# Altium project ArduinoShield.PrjPcb
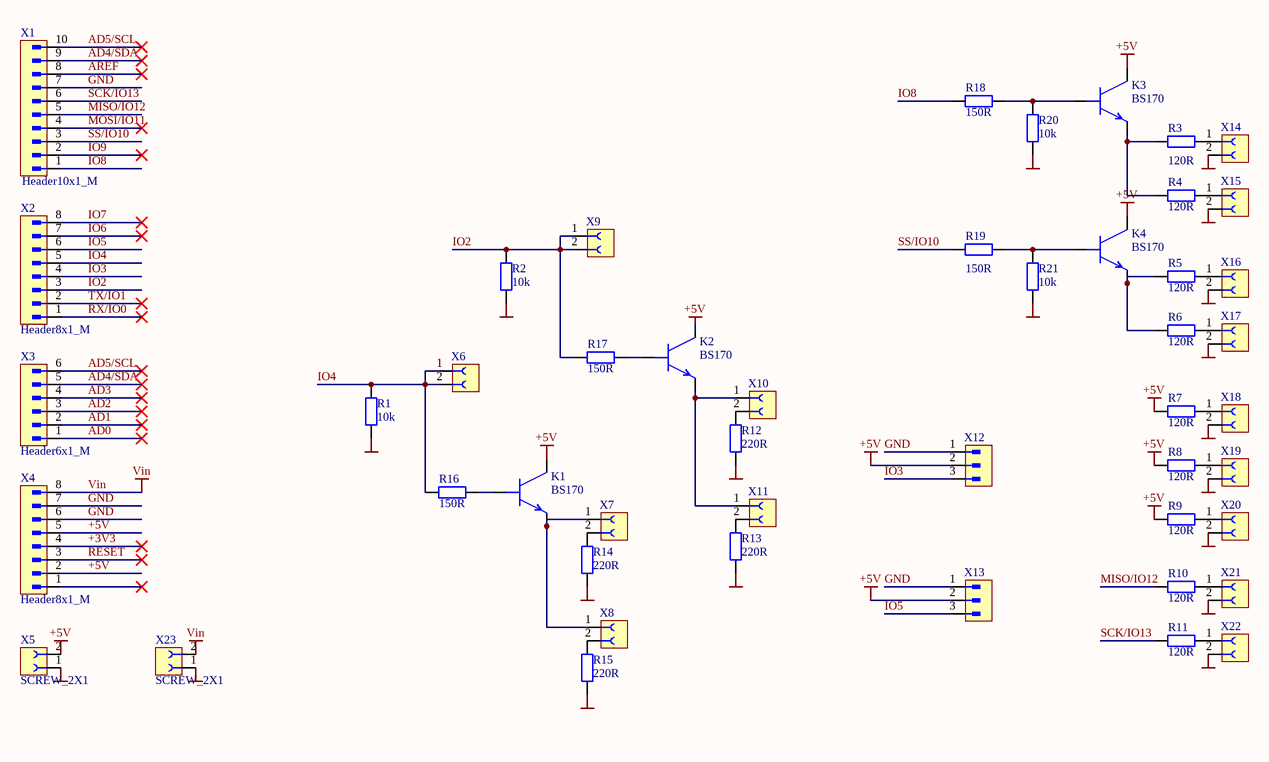
[diagram p0: ArduinoShield.SchDoc]
Author: ACL; ProjectNumber: Shld0.2_Eurobot2022; Revision: 1.1; Title: Shield
1 sheet, 48 parts. Net scope: global (net labels, ports and power ports of the same name join across sheets).
Board file: ArduinoShield.PcbDoc

## Sheet ArduinoShield.SchDoc: Shield
size A3; Organization1: Centre professionnel; Address1: Rue Roger-de-Guimps 41; Address2: CH-1401 Yverdon-les-Bains; Address4: Switzerland; SheetNumber: 1; SheetTotal: 1; Organization2: du Nord vaudois

### Parts
K1  BS170  [TO-92]
K2  BS170  [TO-92]
K3  BS170  [TO-92]
K4  BS170  [TO-92]
R1  10k  [AXIAL-1/2W]
R2  10k  [AXIAL-1/2W]
R3  120R  [AXIAL-1/2W]
R4  120R  [AXIAL-1/2W]
R5  120R  [AXIAL-1/2W]
R6  120R  [AXIAL-1/2W]
R7  120R  [AXIAL-1/2W]
R8  120R  [AXIAL-1/2W]
R9  120R  [AXIAL-1/2W]
R10  120R  [AXIAL-1/2W]
R11  120R  [AXIAL-1/2W]
R12  220R  [AXIAL-1/2W]
R13  220R  [AXIAL-1/2W]
R14  220R  [AXIAL-1/2W]
R15  220R  [AXIAL-1/2W]
R16  150R  [AXIAL-1/2W]
R17  150R  [AXIAL-1/2W]
R18  150R  [AXIAL-1/2W]
R19  150R  [AXIAL-1/2W]
R20  10k  [AXIAL-1/2W]
R21  10k  [AXIAL-1/2W]
X1  Header10x1_M  [HDR10X1_M]
X2  Header8x1_M  [HDR8X1_M]
X3  Header6x1_M  [HDR6X1_M]
X4  Header8x1_M  [HDR8X1_M]
X5  SCREW_2X1  [691210910002]
X6  SCREW_2X1  [691210910002]  (value not drawn)
X7  SCREW_2X1  [691210910002]  (value not drawn)
X8  SCREW_2X1  [691210910002]  (value not drawn)
X9  SCREW_2X1  [691210910002]  (value not drawn)
X10  SCREW_2X1  [691210910002]  (value not drawn)
X11  SCREW_2X1  [691210910002]  (value not drawn)
X12  Header3x1_M  [HDR3X1_M]  (value not drawn)
X13  Header3x1_M  [HDR3X1_M]  (value not drawn)
X14  SCREW_2X1  [691210910002]  (value not drawn)
X15  SCREW_2X1  [691210910002]  (value not drawn)
X16  SCREW_2X1  [691210910002]  (value not drawn)
X17  SCREW_2X1  [691210910002]  (value not drawn)
X18  SCREW_2X1  [691210910002]  (value not drawn)
X19  SCREW_2X1  [691210910002]  (value not drawn)
X20  SCREW_2X1  [691210910002]  (value not drawn)
X21  SCREW_2X1  [691210910002]  (value not drawn)
X22  SCREW_2X1  [691210910002]  (value not drawn)
X23  SCREW_2X1  [691210910002]

### Nets
+5V: K1.1(C) K2.1(C) K3.1(C) K4.1(C) R7.1 R8.1 R9.1 X4.2 X4.5 X5.2 X12.2 X13.2
GND: R1.2 R2.2 R12.2 R13.2 R14.2 R15.2 R20.2 R21.2 X1.7 X4.6 X4.7 X5.1 X12.1 X13.1 X14.2 X15.2 X16.2 X17.2 X18.2 X19.2 X20.2 X21.2 X22.2 X23.1
Vin: X4.8 X23.2
+3V3: X4.4
AD0: X3.1
AD1: X3.2
AD2: X3.3
AD3: X3.4
AD4/SDA: X1.9 X3.5
AD5/SCL: X1.10 X3.6
AREF: X1.8
IO2: R2.1 R17.1 X2.3 X9.1 X9.2
IO3: X2.4 X12.3
IO4: R1.1 R16.1 X2.5 X6.1 X6.2
IO5: X2.6 X13.3
IO6: X2.7
IO7: X2.8
IO8: R18.1 X1.1
IO9: X1.2
MISO/IO12: R10.1 X1.5
MOSI/IO11: X1.4
RESET: X4.3
RX/IO0: X2.1
SCK/IO13: R11.1 X1.6
SS/IO10: R19.1 X1.3
TX/IO1: X2.2
NetK1_2: K1.2(B) R16.2
NetK1_3: K1.3(E) X7.1 X8.1
NetK2_2: K2.2(B) R17.2
NetK2_3: K2.3(E) X10.1 X11.1
NetK3_2: K3.2(B) R18.2 R20.1
NetK3_3: K3.3(E) R3.1 R4.1
NetK4_2: K4.2(B) R19.2 R21.1
NetK4_3: K4.3(E) R5.1 R6.1
NetR3_2: R3.2 X14.1
NetR4_2: R4.2 X15.1
NetR5_2: R5.2 X16.1
NetR6_2: R6.2 X17.1
NetR7_2: R7.2 X18.1
NetR8_2: R8.2 X19.1
NetR9_2: R9.2 X20.1
NetR10_2: R10.2 X21.1
NetR11_2: R11.2 X22.1
NetR12_1: R12.1 X10.2
NetR13_1: R13.1 X11.2
NetR14_1: R14.1 X7.2
NetR15_1: R15.1 X8.2

Not connected (* = marked no-connect by the designer): X4 1*

### Notes on the sheet
- Date:
- Auteur:
- File:
- Format:
- Rev.
- of
- A3

### Library data of the parts
K1-K4 = CMP-013-00045-3: Small Signal Bipolar Transistor, 0.1A I(C), 65V V(BR)CEO, 1-Element, NPN, Silicon, TO-92; hFE: 400; Ic max: 100mA; Vce sat: 600mV; Power: 625mW; Mounting Technology: THT; Pins: 3; Min Operating Temperature: -55°C; Transistor Type: NPN; RoHS Compliant: Yes; Case/Package: TO 92; Max Operating Temperature: 150°C
R1-R21 = RES: Resistor; Supplier 1: CPNV
X1 = CMP-031-000016-3: WURTH ELEKTRONIK - 61301011121 - Pin Header, Board-to-Board, 2.54 mm, 1 Rows, 10 Contacts, Through Hole, WR-PHD Series; Manufacturer: Wurth Electronics; Gender: Male; Connector Type: Male Pin; Voltage Rating: 250V; Insulation Resistance: 1GR; Number of Contacts: 10; Pitch: 2.54mm; Current Rating: 3A; ComponentLink2URL: https://datasheet.ciiva.com/7631/1442175-7631321.pdf?src-supplier=Element14; Pricing 1: 1=0.89000, 10=0.87400, 50=0.73900, 100=0.67200, 1000=0.42700, 10000=0.42700 (USD); ComponentLink1Description: https://datasheet.ciiva.com/738/6130xx11121-738550.pdf?src-supplier=Digi-Key; RoHS Compliant: Yes; Source: MEION_Connectors.SchLib; Pricing 2: 1=0.89000, 10=0.87400, 50=0.80600, 100=0.73900, 200=0.67200 (USD); Contact Gender: Male; Contact Mating Length: 0.236inch; Design Item ID: Header10x1_M; RoHS: Yes; ComponentLink3URL: https://datasheet.ciiva.com/48700/001088187-da-01-en-wr-phd-tht-stiftleiste-61301011121-48700876.pdf?src-supplier=Conrad; Category: Headers and Wire Housings; Contact Type: Male Pin; Contact Plating: Gold; Stock 1: 1900; Mount: Through Hole; ComponentLink1URL: https://datasheet.ciiva.com/738/6130xx11121-738550.pdf?src-supplier=Digi-Key; Package Quantity: 1000; Manufacturer Part Number: 61301011121; Max Operating Temperature: 125°C; Number of Rows: 1; Flammability Rating: UL94 V-0; ComponentLink3Description: https://datasheet.ciiva.com/48700/001088187-da-01-en-wr-phd-tht-stiftleiste-61301011121-48700876.pdf?src-supplier=Conrad; Min Operating Temperature: -40°C; Stock 2: 4313; Termination: Solder; Packaging: Bulk; Length: 2.54mm; ComponentLink2Description: https://datasheet.ciiva.com/7631/1442175-7631321.pdf?src-supplier=Element14; Number of Positions: 10; REACH SVHC: Unknown; Height: 11.54mm; Orientation: Straight; Color: Black; Housing Material: PBT; Series: WR-PHD; Contact Material: Copper Alloy,Copper; Width: 25.4mm
X2 X4 = CMP-031-000015-3: Board-To-Board Connector, Vertical, Wr-Phd Series, Through Hole, Header, 8, 2.54 Mm; Manufacturer: Wurth Electronics; Manufacturer Part Number: 61300811121; Connector Type: Male Pin; Pitch: 0.1inch; Gender: Male; Number of Contacts: 8; Mount: Through Hole; Category: Connectors; RoHS: Yes; Color: Black; RoHS Compliant: Yes; Packaging: Bulk; ComponentLink1Description: http://www.farnell.com/cad/1737268.pdf?src-supplier=Element14; Termination: Solder; Contact Material: Copper; Contact Plating: Gold; Pricing 1: 1=0.37000, 10=0.31500, 50=0.21900, 100=0.19900, 1000=0.18100, 10000=0.18100 (USD); REACH SVHC: Unknown; Design Item ID: Header8x1_M; Source: MEION_Connectors.SchLib; Contact Mating Length: 0.236inch; ComponentLink1URL: http://www.farnell.com/cad/1737268.pdf?src-supplier=Element14; ComponentLink2URL: https://katalog.we-online.de/em/datasheet/6130xx11121.pdf?src-supplier=Digi-Key; ComponentLink2Description: https://katalog.we-online.de/em/datasheet/6130xx11121.pdf?src-supplier=Digi-Key; Pricing 2: 1=0.37000, 10=0.31500, 25=0.26320, 50=0.21900, 100=0.19900, 1000=0.18100 (USD); Stock 2: 10891; Number of Positions: 8; Number of Rows: 1; Stock 1: 4202
X3 = CMP-031-000013-3: WURTH ELEKTRONIK - 61300611121 - Pin Header, Board-to-Board, 2.54 mm, 1 Rows, 6 Contacts, Through Hole, WR-PHD Series; Manufacturer: Wurth Electronics; Connector Type: Male Pin; Number of Positions: 6; Pitch: 0.1inch; Gender: Male; Voltage Rating: 250V; Current Rating: 3A; Pricing 2: 1=0.33000, 10=0.27900, 25=0.23200, 50=0.19400, 100=0.17600, 1000=0.16000 (USD); Termination: Through Hole; Pricing 1: 1=0.33000, 10=0.27900, 50=0.19400, 100=0.17600, 1000=0.16000, 10000=0.16000 (USD); Number of Rows: 1; Housing Material: PBT; Mount: Through Hole; Stock 1: 7278; Design Item ID: Header6x1_M; REACH SVHC: Unknown; ComponentLink1URL: http://www.mouser.com/ds/2/445/6130xx11121-538006.pdf?src-supplier=Mouser; ComponentLink1Description: http://www.mouser.com/ds/2/445/6130xx11121-538006.pdf?src-supplier=Mouser; Stock 2: 46170; RoHS: Yes; Manufacturer Part Number: 61300611121; ComponentLink3URL: http://www.farnell.com/cad/1737268.pdf?src-supplier=Element14; Contact Gender: Male; ComponentLink2Description: https://katalog.we-online.de/em/datasheet/6130xx11121.pdf?src-supplier=Digi-Key; Contact Material: Copper Alloy,Copper; Max Operating Temperature: 125°C; Packaging: Bulk; Min Operating Temperature: -40°C; Color: Black; Number of Contacts: 6; Lead Free: Lead Free; Contact Mating Length: 0.236inch; Source: MEION_Connectors.SchLib; ComponentLink2URL: https://katalog.we-online.de/em/datasheet/6130xx11121.pdf?src-supplier=Digi-Key; Contact Plating: Gold; Category: Headers and Wire Housings; ComponentLink3Description: http://www.farnell.com/cad/1737268.pdf?src-supplier=Element14
X5-X11 X14-X23 = CMP-119-000000-3: WR-TBL Serie 2109 Horizontal Entry, Rising Cage Clamp, THT, pitch 2.54mm, 2p; Rated Current [UL]: 6A; PCB/Cable/Panel: PCB; Modularity: No; Pin Number: 2; Working Voltage [UL]: 150VAC; ComponentLink2URL: https://katalog.we-online.de/em/datasheet/691210910002.pdf; ComponentLink1Description: Manufacturer; Type: Horizontal; Design Item ID: 691210910002; Mounting Technology: THT; Published Date: Feburary 2021; Application: Rising Cage Clamp; ComponentLink1URL: http://www.we-online.de; Source: WR-TBL_Rising Cage Clamp.SchLib; Pitch: 2.54mm; Operating Temperature: -40 to +105degC; Packaging: Box; Component Type: Standard; ComponentLink2Description: Datasheet; Pin Count: 2
X12 X13 = CMP-031-000005-4: WR-PHD 2.54 mm THT Pin Header; Manufacturer Part Number: 61300311121; Manufacturer: Wurth Electronics; Connector Type: Male Pin; Gender: Male; Pitch: 0.1inch; Number of Contacts: 3; Number of Rows: 1; Stock 1: 52616; Publisher: Altium Limited; ComponentLink1URL: http://www.farnell.com/cad/1737268.pdf?src-supplier=Element14; Design Item ID: Header3x1_M; ComponentLink2URL: https://katalog.we-online.de/em/datasheet/6130xx11121.pdf?src-supplier=Digi-Key; Mount: Through Hole; Termination: Solder; Color: Black; Source: MEION_Connectors.SchLib; RoHS: Yes; Contact Material: Copper; LatestRevisionNote: Re-released for DXP Platform.; LatestRevisionDate: 17-Jul-2002; Packaging: Bulk; Number of Positions: 3; Category: Connectors; REACH SVHC: Unknown; ComponentLink2Description: https://katalog.we-online.de/em/datasheet/6130xx11121.pdf?src-supplier=Digi-Key; Lead Free: Lead Free; ComponentLink1Description: http://www.farnell.com/cad/1737268.pdf?src-supplier=Element14; Contact Plating: Gold; Price: 0; Contact Mating Length: 0.236inch